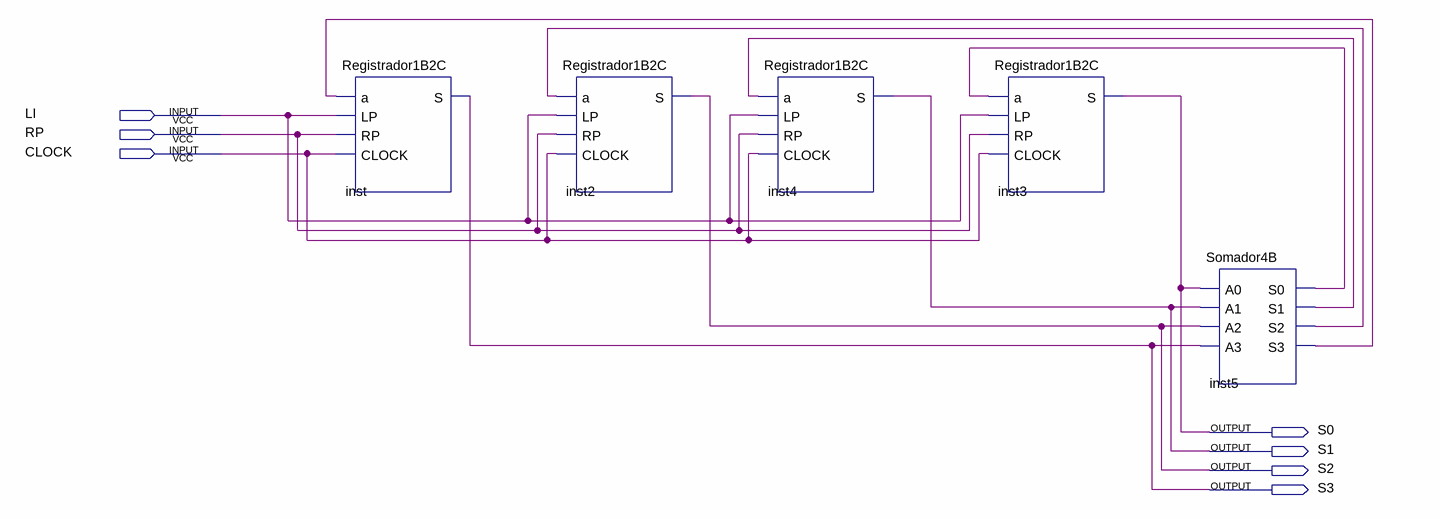
[diagram p0: schematic sheet]
// Quartus schematic ContadorI.bdf as structural Verilog: 5 symbols, 7 pins
module ContadorI (
  input  LI,
  input  RP,
  input  CLOCK,
  output S0,
  output S1,
  output S2,
  output S3
);

  wire inst5_s0, inst5_s1, inst5_s2, inst5_s3;

  Registrador1B2C inst (.a(inst5_s3), .LP(LI), .RP(RP), .CLOCK(CLOCK), .S(S3));
  Registrador1B2C inst2 (.a(inst5_s2), .LP(LI), .RP(RP), .CLOCK(CLOCK), .S(S2));
  Registrador1B2C inst4 (.a(inst5_s1), .LP(LI), .RP(RP), .CLOCK(CLOCK), .S(S1));
  Registrador1B2C inst3 (.a(inst5_s0), .LP(LI), .RP(RP), .CLOCK(CLOCK), .S(S0));
  Somador4B inst5 (.A0(S0), .A1(S1), .A2(S2), .A3(S3), .S0(inst5_s0), .S1(inst5_s1), .S2(inst5_s2), .S3(inst5_s3));
endmodule
